# Altium schematic sheet LEDs.SchDoc
size A4
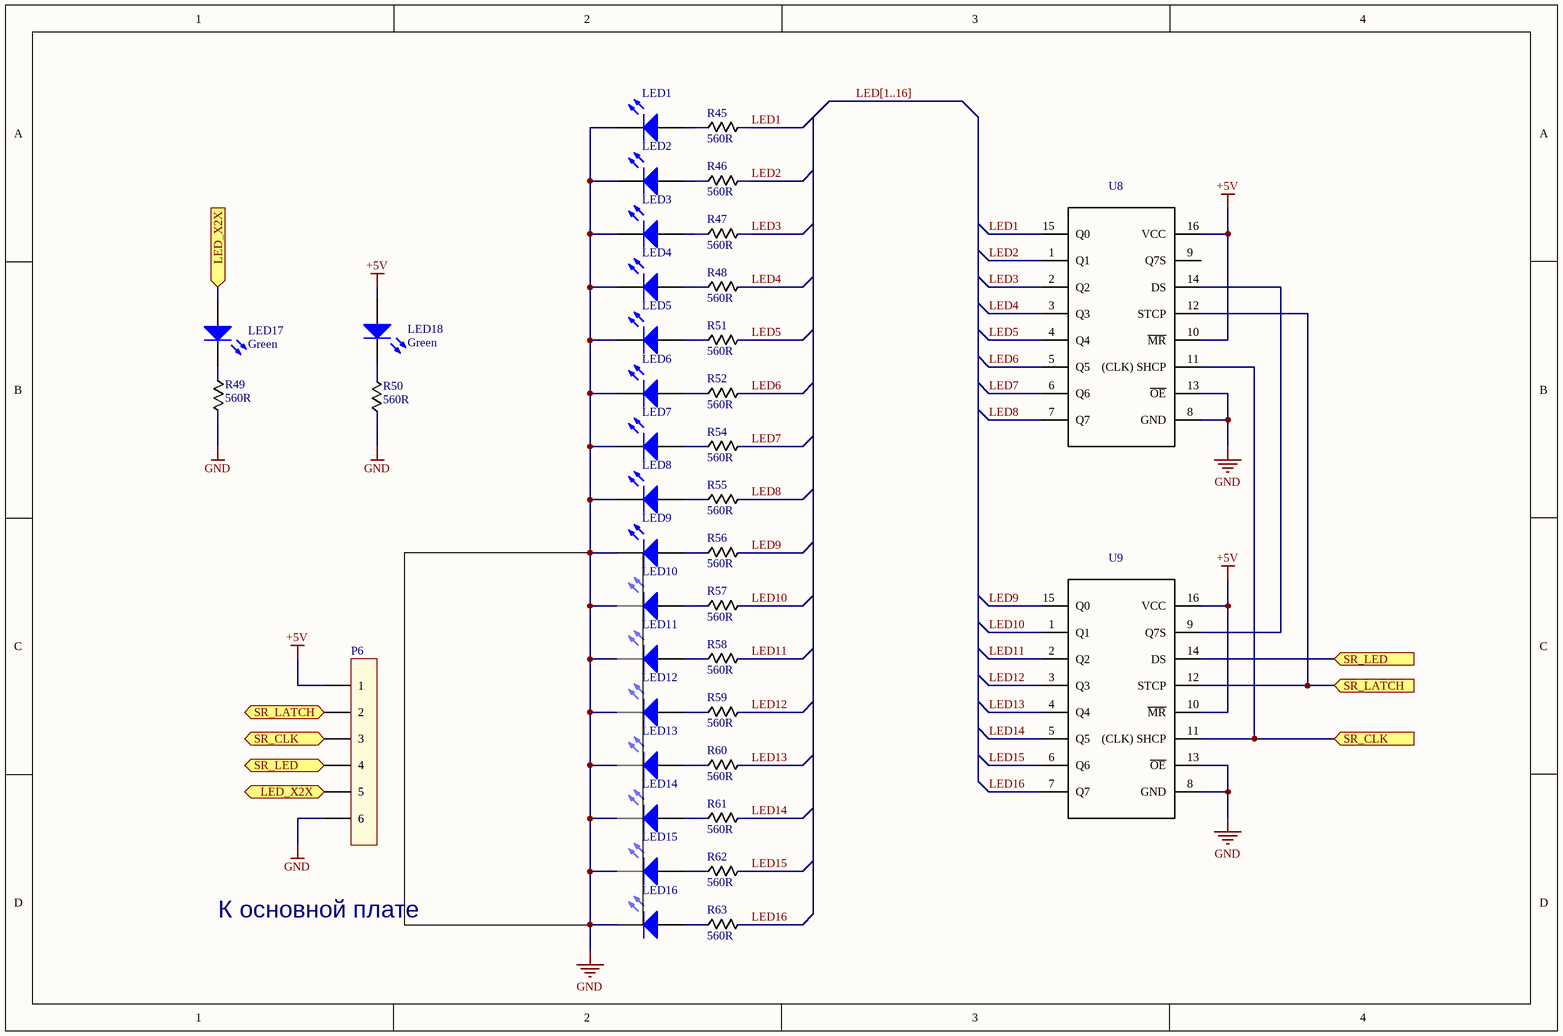
[diagram p0: LEDs.SchDoc]

## Parts
LED1  Green  [LED SMD 0603]  (value not drawn)
LED2  Green  [LED SMD 0603]  (value not drawn)
LED3  Green  [LED SMD 0603]  (value not drawn)
LED4  Green  [LED SMD 0603]  (value not drawn)
LED5  Green  [LED SMD 0603]  (value not drawn)
LED6  Green  [LED SMD 0603]  (value not drawn)
LED7  Green  [LED SMD 0603]  (value not drawn)
LED8  Green  [LED SMD 0603]  (value not drawn)
LED9  Green  [LED SMD 0603]  (value not drawn)
LED10  Green  [LED SMD 0603]  (value not drawn)
LED11  Green  [LED SMD 0603]  (value not drawn)
LED12  Green  [LED SMD 0603]  (value not drawn)
LED13  Green  [LED SMD 0603]  (value not drawn)
LED14  Green  [LED SMD 0603]  (value not drawn)
LED15  Green  [LED SMD 0603]  (value not drawn)
LED16  Green  [LED SMD 0603]  (value not drawn)
LED17  Green  [LED SMD 0603]
LED18  Green  [LED SMD 0603]
P6  (no value)  [PLS-6 2.54 - OnlyHoles]  (no BOM)
R45  560R  [0603_RES]
R46  560R  [0603_RES]
R47  560R  [0603_RES]
R48  560R  [0603_RES]
R49  560R  [0603_RES]
R50  560R  [0603_RES]
R51  560R  [0603_RES]
R52  560R  [0603_RES]
R54  560R  [0603_RES]
R55  560R  [0603_RES]
R56  560R  [0603_RES]
R57  560R  [0603_RES]
R58  560R  [0603_RES]
R59  560R  [0603_RES]
R60  560R  [0603_RES]
R61  560R  [0603_RES]
R62  560R  [0603_RES]
R63  560R  [0603_RES]
U8  (no value)  [SOIC 16]
U9  (no value)  [SOIC 16]

## Ports
LED_X2X, SR_CLK, SR_LATCH, SR_LED

## Nets
+5V: LED18.1(A) P6.1 U8.10(~{MR}) U8.16(VCC) U9.10(~{MR}) U9.16(VCC)
GND: LED1.2(K) LED2.2(K) LED3.2(K) LED4.2(K) LED5.2(K) LED6.2(K) LED7.2(K) LED8.2(K) LED9.2(K) LED10.2(K) LED11.2(K) LED12.2(K) LED13.2(K) LED14.2(K) LED15.2(K) LED16.2(K) P6.6 R49.2 R50.1 U8.8(GND) U8.13(~{OE}) U9.8(GND) U9.13(~{OE})
LED1: R45.2 U8.15(Q0)
LED2: R46.2 U8.1(Q1)
LED3: R47.2 U8.2(Q2)
LED4: R48.2 U8.3(Q3)
LED5: R51.2 U8.4(Q4)
LED6: R52.2 U8.5(Q5)
LED7: R54.2 U8.6(Q6)
LED8: R55.2 U8.7(Q7)
LED9: R56.2 U9.15(Q0)
LED10: R57.2 U9.1(Q1)
LED11: R58.2 U9.2(Q2)
LED12: R59.2 U9.3(Q3)
LED13: R60.2 U9.4(Q4)
LED14: R61.2 U9.5(Q5)
LED15: R62.2 U9.6(Q6)
LED16: R63.2 U9.7(Q7)
LED_X2X: LED17.1(A) P6.5 ; port LED_X2X
SR_CLK: P6.3 U8.11((CLK)_SHCP) U9.11((CLK)_SHCP) ; port SR_CLK
SR_LATCH: P6.2 U8.12(STCP) U9.12(STCP) ; port SR_LATCH
SR_LED: P6.4 U9.14(DS) ; port SR_LED
NetLED1_1: LED1.1(A) R45.1
NetLED2_1: LED2.1(A) R46.1
NetLED3_1: LED3.1(A) R47.1
NetLED4_1: LED4.1(A) R48.1
NetLED5_1: LED5.1(A) R51.1
NetLED6_1: LED6.1(A) R52.1
NetLED7_1: LED7.1(A) R54.1
NetLED8_1: LED8.1(A) R55.1
NetLED9_1: LED9.1(A) R56.1
NetLED10_1: LED10.1(A) R57.1
NetLED11_1: LED11.1(A) R58.1
NetLED12_1: LED12.1(A) R59.1
NetLED13_1: LED13.1(A) R60.1
NetLED14_1: LED14.1(A) R61.1
NetLED15_1: LED15.1(A) R62.1
NetLED16_1: LED16.1(A) R63.1
NetLED17_2: LED17.2(K) R49.1
NetLED18_2: LED18.2(K) R50.2
NetU8_14: U8.14(DS) U9.9(Q7S)

Not connected (* = marked no-connect by the designer): U8 9(Q7S)

## Buses and harness runs
bus LED[1..16]

## Notes on the sheet
- К основной плате

## Library data of the parts
LED1-LED18 = 0603 LED: Part Description: Single Colour LED Green; Part Number: KP-1608SGC
P6 = PLS-6: Part Number: PLS-6
R45-R52 R54-R63 = 0603 RES: Part Description: Resistor 0603, 560Ohms, 5%, 1/10W; Part Number: RC0603JR-07560RL
U8 U9 = 74HC595: Part Description: 8-Bit Shift DDRister/Latch; Part Number: 74HC595D.118